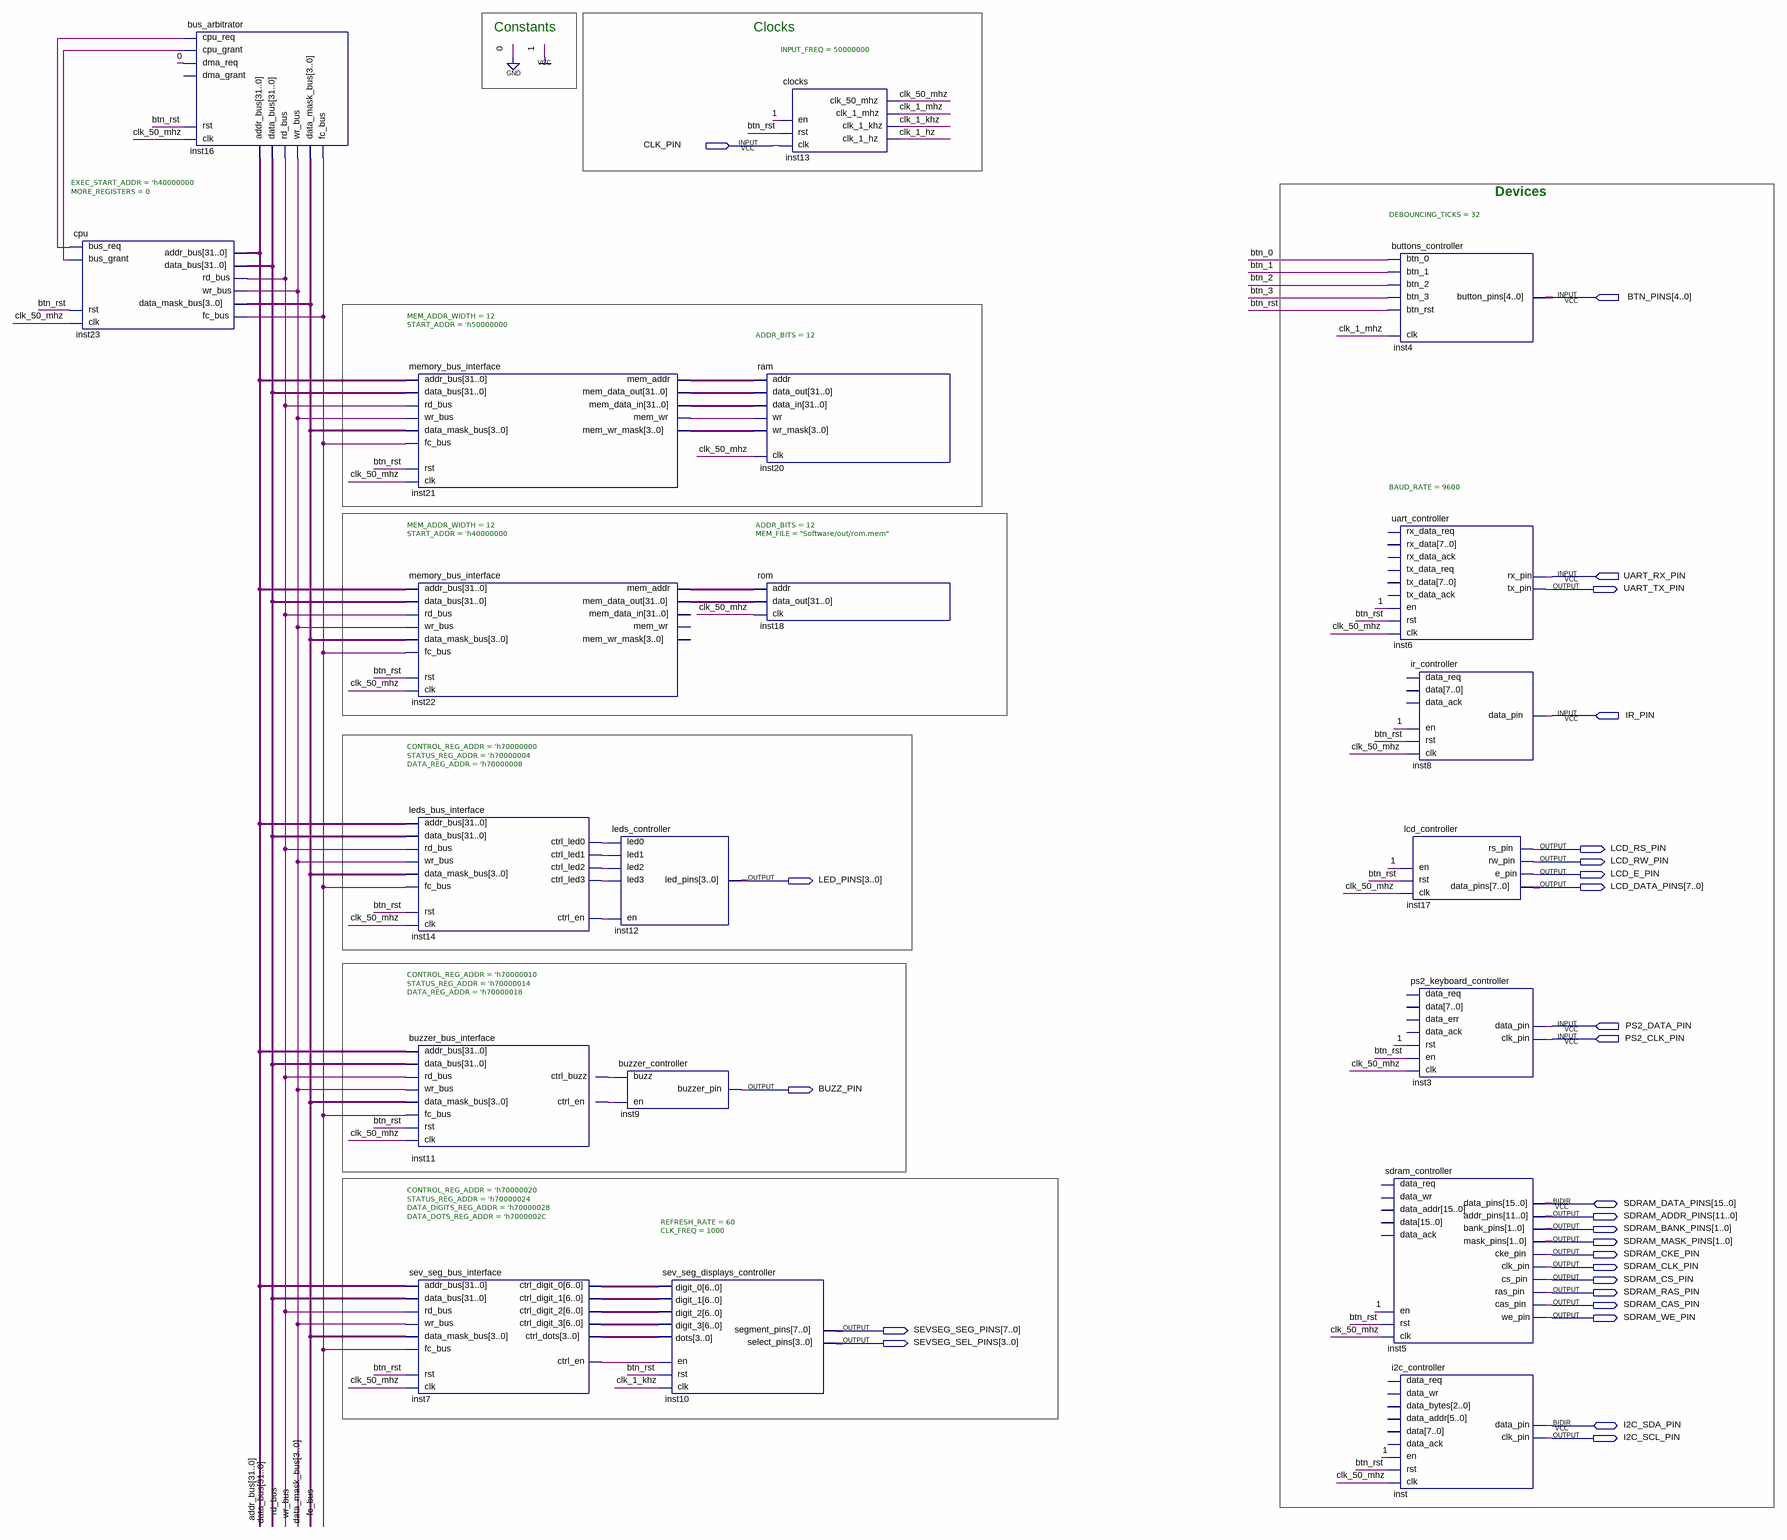
[diagram p0: schematic sheet]
// Quartus schematic Niski.bdf as structural Verilog: 20 symbols, 27 pins
module Niski (
  input  CLK_PIN,
  input  [4:0] BTN_PINS,
  input  UART_RX_PIN,
  input  IR_PIN,
  input  PS2_DATA_PIN,
  input  PS2_CLK_PIN,
  inout  [15:0] SDRAM_DATA_PINS,
  inout  I2C_SDA_PIN,
  output UART_TX_PIN,
  output LCD_RS_PIN,
  output LCD_RW_PIN,
  output LCD_E_PIN,
  output [3:0] LED_PINS,
  output [7:0] LCD_DATA_PINS,
  output BUZZ_PIN,
  output [11:0] SDRAM_ADDR_PINS,
  output [1:0] SDRAM_BANK_PINS,
  output [1:0] SDRAM_MASK_PINS,
  output SDRAM_CKE_PIN,
  output SDRAM_CLK_PIN,
  output SDRAM_CS_PIN,
  output SDRAM_RAS_PIN,
  output SDRAM_CAS_PIN,
  output SDRAM_WE_PIN,
  output [7:0] SEVSEG_SEG_PINS,
  output [3:0] SEVSEG_SEL_PINS,
  output I2C_SCL_PIN
);

  wire btn_0, btn_1, btn_2, btn_3, btn_rst, clk_1_hz, clk_1_khz, clk_1_mhz, clk_50_mhz, fc_bus,
       inst7_ctrl_en, inst11_ctrl_buzz, inst11_ctrl_en, inst14_ctrl_en, inst14_ctrl_led0, inst14_ctrl_led1,
       inst14_ctrl_led2, inst14_ctrl_led3, inst16_cpu_grant, inst21_mem_wr, inst23_bus_req, rd_bus, wr_bus;
  wire [3:0] data_mask_bus, inst7_ctrl_dots, inst21_mem_wr_mask;
  wire [6:0] inst7_ctrl_digit_0, inst7_ctrl_digit_1, inst7_ctrl_digit_2, inst7_ctrl_digit_3;
  wire [11:0] inst21_mem_addr, inst22_mem_addr;
  wire [31:0] addr_bus, data_bus, inst18_data_out, inst20_data_out, inst21_mem_data_in;

  cpu #(.EXEC_START_ADDR('h40000000), .MORE_REGISTERS(0)) inst23 (
    .clk(clk_50_mhz), .rst(btn_rst), .bus_grant(inst16_cpu_grant), .fc_bus(fc_bus), .bus_req(inst23_bus_req),
    .addr_bus(addr_bus), .wr_bus(wr_bus), .rd_bus(rd_bus), .data_mask_bus(data_mask_bus), .data_bus(data_bus));
  bus_arbitrator inst16 (
    .clk(clk_50_mhz), .rst(btn_rst), .cpu_req(inst23_bus_req), .dma_req(1'b0), .cpu_grant(inst16_cpu_grant),
    .addr_bus(addr_bus), .data_bus(data_bus), .wr_bus(wr_bus), .rd_bus(rd_bus),
    .data_mask_bus(data_mask_bus), .fc_bus(fc_bus));  // open: dma_grant
  memory_bus_interface #(.MEM_ADDR_WIDTH(12), .START_ADDR('h50000000)) inst21 (
    .clk(clk_50_mhz), .rst(btn_rst), .mem_data_out(inst20_data_out), .addr_bus(addr_bus), .wr_bus(wr_bus),
    .rd_bus(rd_bus), .data_mask_bus(data_mask_bus), .mem_data_in(inst21_mem_data_in), .mem_wr(inst21_mem_wr),
    .mem_wr_mask(inst21_mem_wr_mask), .fc_bus(fc_bus), .mem_addr(inst21_mem_addr), .data_bus(data_bus));
  memory_bus_interface #(.MEM_ADDR_WIDTH(12), .START_ADDR('h40000000)) inst22 (
    .clk(clk_50_mhz), .rst(btn_rst), .mem_data_out(inst18_data_out), .addr_bus(addr_bus), .wr_bus(wr_bus),
    .rd_bus(rd_bus), .data_mask_bus(data_mask_bus), .fc_bus(fc_bus), .mem_addr(inst22_mem_addr),
    .data_bus(data_bus));  // open: mem_data_in, mem_wr, mem_wr_mask
  leds_bus_interface #(.CONTROL_REG_ADDR('h70000000), .STATUS_REG_ADDR('h70000004), .DATA_REG_ADDR('h70000008)) inst14 (
    .clk(clk_50_mhz), .rst(btn_rst), .addr_bus(addr_bus), .rd_bus(rd_bus), .wr_bus(wr_bus),
    .data_mask_bus(data_mask_bus), .ctrl_en(inst14_ctrl_en), .ctrl_led0(inst14_ctrl_led0),
    .ctrl_led1(inst14_ctrl_led1), .ctrl_led2(inst14_ctrl_led2), .ctrl_led3(inst14_ctrl_led3),
    .fc_bus(fc_bus), .data_bus(data_bus));
  buzzer_bus_interface #(.CONTROL_REG_ADDR('h70000010), .STATUS_REG_ADDR('h70000014), .DATA_REG_ADDR('h70000018)) inst11 (
    .clk(clk_50_mhz), .rst(btn_rst), .addr_bus(addr_bus), .rd_bus(rd_bus), .wr_bus(wr_bus),
    .data_mask_bus(data_mask_bus), .ctrl_en(inst11_ctrl_en), .ctrl_buzz(inst11_ctrl_buzz), .fc_bus(fc_bus),
    .data_bus(data_bus));
  sev_seg_bus_interface #(.CONTROL_REG_ADDR('h70000020), .STATUS_REG_ADDR('h70000024), .DATA_DIGITS_REG_ADDR('h70000028), .DATA_DOTS_REG_ADDR('h7000002C)) inst7 (
    .clk(clk_50_mhz), .rst(btn_rst), .addr_bus(addr_bus), .rd_bus(rd_bus), .wr_bus(wr_bus),
    .data_mask_bus(data_mask_bus), .ctrl_en(inst7_ctrl_en), .ctrl_digit_0(inst7_ctrl_digit_0),
    .ctrl_digit_1(inst7_ctrl_digit_1), .ctrl_digit_2(inst7_ctrl_digit_2), .ctrl_digit_3(inst7_ctrl_digit_3),
    .ctrl_dots(inst7_ctrl_dots), .fc_bus(fc_bus), .data_bus(data_bus));
  leds_controller inst12 (
    .en(inst14_ctrl_en), .led0(inst14_ctrl_led0), .led1(inst14_ctrl_led1), .led2(inst14_ctrl_led2),
    .led3(inst14_ctrl_led3), .led_pins(LED_PINS));
  buzzer_controller inst9 (.en(inst11_ctrl_en), .buzz(inst11_ctrl_buzz), .buzzer_pin(BUZZ_PIN));
  sev_seg_displays_controller #(.REFRESH_RATE(60), .CLK_FREQ(1000)) inst10 (
    .clk(clk_1_khz), .rst(btn_rst), .en(inst7_ctrl_en), .digit_0(inst7_ctrl_digit_0),
    .digit_1(inst7_ctrl_digit_1), .digit_2(inst7_ctrl_digit_2), .digit_3(inst7_ctrl_digit_3),
    .dots(inst7_ctrl_dots), .segment_pins(SEVSEG_SEG_PINS), .select_pins(SEVSEG_SEL_PINS));
  clocks #(.INPUT_FREQ(50000000)) inst13 (
    .clk(CLK_PIN), .en(1'b1), .rst(btn_rst), .clk_50_mhz(clk_50_mhz), .clk_1_mhz(clk_1_mhz),
    .clk_1_khz(clk_1_khz), .clk_1_hz(clk_1_hz));
  ram #(.ADDR_BITS(12)) inst20 (
    .clk(clk_50_mhz), .wr(inst21_mem_wr), .wr_mask(inst21_mem_wr_mask), .data_in(inst21_mem_data_in),
    .addr(inst21_mem_addr), .data_out(inst20_data_out));
  rom #(.ADDR_BITS(12), .MEM_FILE("Software/out/rom.mem")) inst18 (
    .clk(clk_50_mhz), .addr(inst22_mem_addr), .data_out(inst18_data_out));
  buttons_controller #(.DEBOUNCING_TICKS(32)) inst4 (
    .clk(clk_1_mhz), .button_pins(BTN_PINS), .btn_0(btn_0), .btn_1(btn_1), .btn_2(btn_2), .btn_3(btn_3),
    .btn_rst(btn_rst));
  uart_controller #(.BAUD_RATE(9600)) inst6 (
    .clk(clk_50_mhz), .rst(btn_rst), .en(1'b1), .rx_pin(UART_RX_PIN), .tx_pin(UART_TX_PIN));  // open: tx_data_req, tx_data, rx_data_req, tx_data_ack, rx_data, rx_data_ack
  sdram_controller inst5 (
    .clk(clk_50_mhz), .rst(btn_rst), .en(1'b1), .addr_pins(SDRAM_ADDR_PINS), .bank_pins(SDRAM_BANK_PINS),
    .mask_pins(SDRAM_MASK_PINS), .cke_pin(SDRAM_CKE_PIN), .clk_pin(SDRAM_CLK_PIN), .cs_pin(SDRAM_CS_PIN),
    .ras_pin(SDRAM_RAS_PIN), .cas_pin(SDRAM_CAS_PIN), .we_pin(SDRAM_WE_PIN), .data_pins(SDRAM_DATA_PINS));  // open: data_req, data_wr, data_addr, data_ack, data
  i2c_controller inst (
    .clk(clk_50_mhz), .rst(btn_rst), .en(1'b1), .clk_pin(I2C_SCL_PIN), .data_pin(I2C_SDA_PIN));  // open: data_req, data_wr, data_addr, data_bytes, data_ack, data
  ir_controller inst8 (
    .clk(clk_50_mhz), .rst(btn_rst), .en(1'b1), .data_pin(IR_PIN));  // open: data_req, data, data_ack
  lcd_controller inst17 (
    .clk(clk_50_mhz), .rst(btn_rst), .en(1'b1), .rs_pin(LCD_RS_PIN), .rw_pin(LCD_RW_PIN), .e_pin(LCD_E_PIN),
    .data_pins(LCD_DATA_PINS));
  ps2_keyboard_controller inst3 (
    .clk(clk_50_mhz), .rst(1'b1), .en(btn_rst), .data_pin(PS2_DATA_PIN), .clk_pin(PS2_CLK_PIN));  // open: data_req, data, data_err, data_ack

  // Notes on the sheet:
  //   Constants
  //   Clocks
  //   Devices
endmodule
